# EasyEDA schematic NIR_Schematic.json
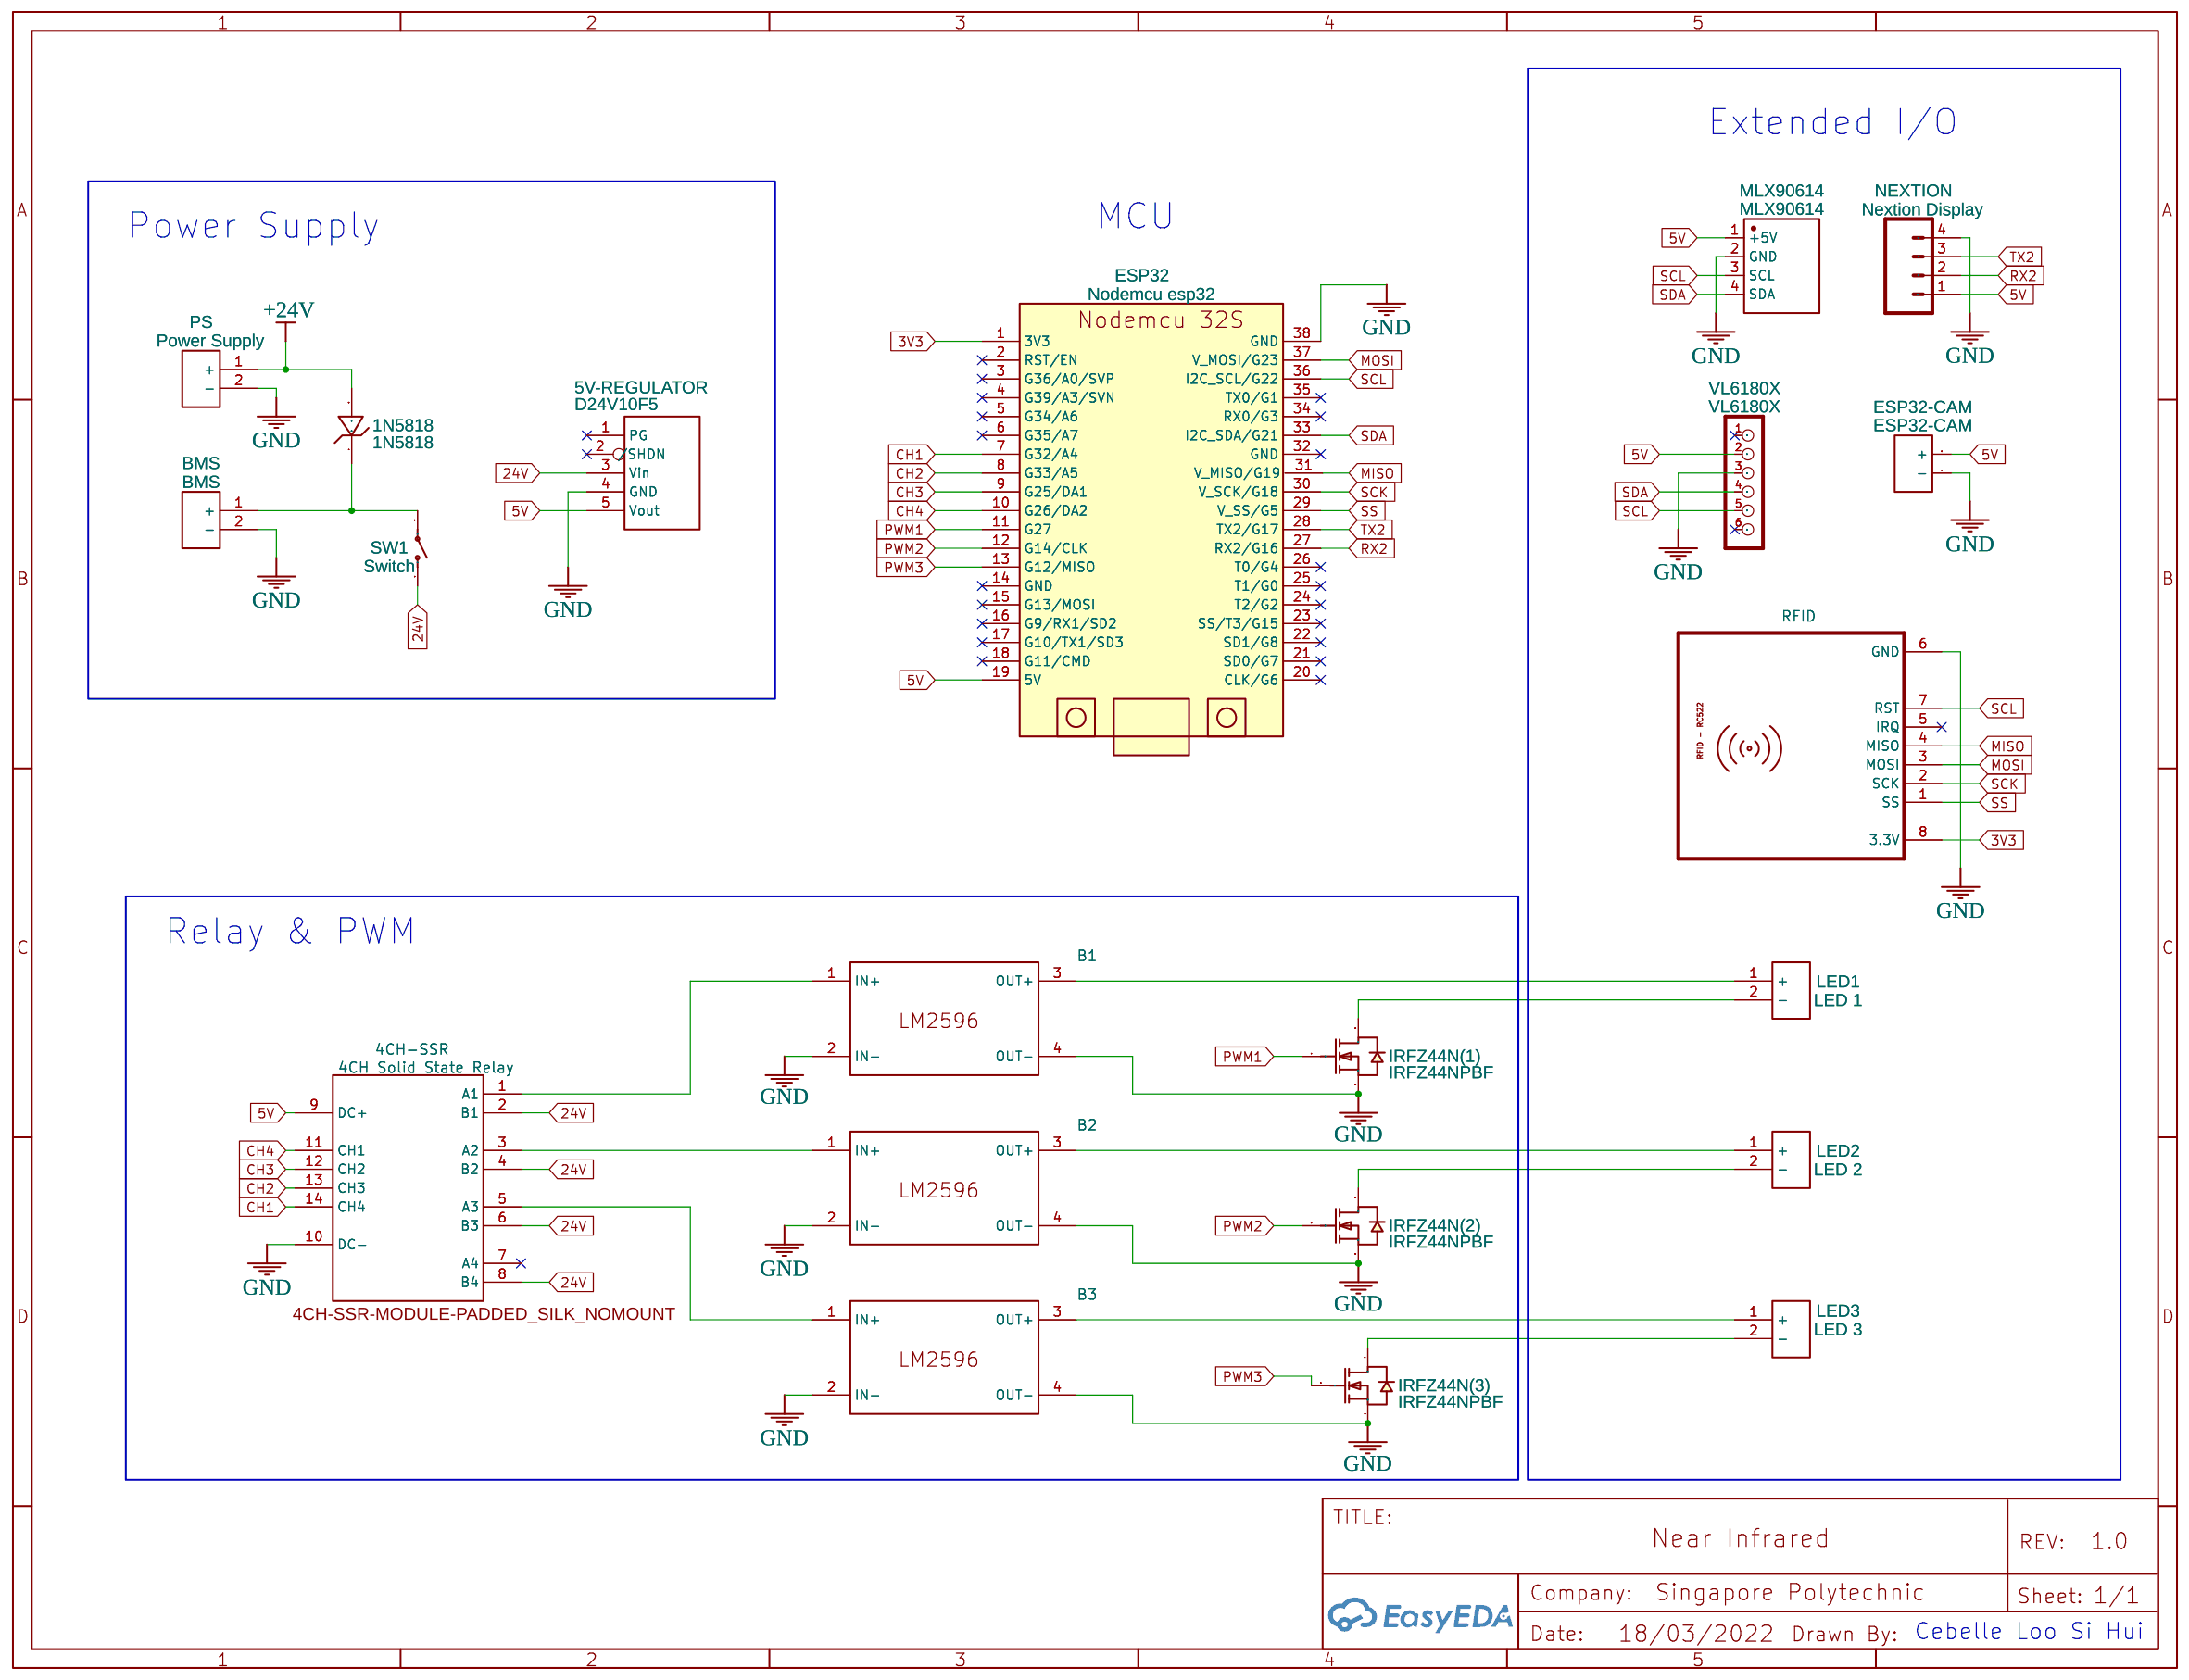
[diagram p0: schematic sheet]

## Parts
1N5818  1N5818  [DO-41_BD2.4-L4.7-P8.70-D0.9-RD]
4CH-SSR  4CH Solid State Relay  [4CH-SSR-MODULE-PADDED_SILK_NOMOUNT]
5V-REGULATOR  D24V10F5  [POLOLU D24V10F5]
B1  NO  [LM2596-MODULE]
B2  NO  [LM2596-MODULE]
B3  NO  [LM2596-MODULE]
BMS  BMS  [2PIN-TERMINALBLOCK-5MM]
ESP32  Nodemcu esp32  [NODEMCU-ESP32S]
ESP32-CAM  ESP32-CAM  [HDR-TH_2P-P2.54-V-F]
IRFZ44N(1)  IRFZ44NPBF  [PG-TO220-3_L10.0-W4.5-P2.54-L]
IRFZ44N(2)  IRFZ44NPBF  [PG-TO220-3_L10.0-W4.5-P2.54-L]
IRFZ44N(3)  IRFZ44NPBF  [PG-TO220-3_L10.0-W4.5-P2.54-L]
LED1  LED 1  [2PIN-TERMINALBLOCK-5MM]
LED2  LED 2  [2PIN-TERMINALBLOCK-5MM]
LED3  LED 3  [2PIN-TERMINALBLOCK-5MM]
MLX90614  MLX90614  [HDR1X4]
NEXTION  Nextion Display  [MOLEX-1X4]
PS  Power Supply  [2PIN-TERMINALBLOCK-5MM]
RFID  NO  [RC522 N]
SW1  Switch  [2PIN-TERMINALBLOCK-5MM]
VL6180X  VL6180X  [M1X6]

## Library data of the parts
1N5818 = 1N5818: Supplier: LCSC; Supplier Part: C402217; Manufacturer: LGE; Contributor: LCSC; JLCPCB Part Class: Extended Part
4CH-SSR = -: Package Display: Yes
5V-REGULATOR = D24V10F5: Contributor: sorinfxdx; sourceId: dNGYgysK2
B1-B3 = -: Package Display: No
BMS LED1 PS = WJ103-5.00-2P: Supplier: LCSC; Manufacturer: ReliaPro; Supplier Part: C8439; JLCPCB Part Class: Extended Part; Package Display: No
ESP32 = Nodemcu esp32: Contributor: SSanya
ESP32-CAM = Header-Female-2.54_1x2: Supplier: LCSC; Manufacturer: BOOMELE; Manufacturer Part: 2.54-1*2PFemale; Supplier Part: C49661; JLCPCB Part Class: Extended Part
IRFZ44N(1) IRFZ44N(2) IRFZ44N(3) = IRFZ44NPBF: Supplier: LCSC; Manufacturer: IR; Supplier Part: C2586; JLCPCB Part Class: Extended Part
LED2 LED3 = WJ103-5.00-2P: Supplier: LCSC; Manufacturer: ReliaPro; Supplier Part: C8439; JLCPCB Part Class: Extended Part
MLX90614 = RE-H042TD-1190(LF)(SN): Supplier: LCSC; Supplier Part: C265319; Manufacturer: JST Sales America; Contributor: LCSC
NEXTION = M04POLAR: Header 4; Contributor: SparkFun
SW1 = SWITCH-2P-SPST-Rocker-10x15mm: Manufacturer Part: KCD1-11-1.5x1cm; Supplier: Aliexpress; link: https://www.aliexpress.com/item/32920360920.html?spm=a2g0s.9042311.0.0.27424c4dCPvDQN; Contributor: shaman0
VL6180X = CON_HEADER_1X06-PTH: Contributor: DangerousPrototype

## Nets
3V3: ESP32.1(3V3) RFID.8(3.3V)
5V: 4CH-SSR.9(DC+) 5V-REGULATOR.5(Vout) ESP32.19(5V) ESP32-CAM.2(+) MLX90614.1(+5V) NEXTION.1(GND) VL6180X.2(VIN)
24V: 4CH-SSR.2(B1) 4CH-SSR.4(B2) 4CH-SSR.6(B3) 4CH-SSR.8(B4) 5V-REGULATOR.3(Vin) SW1.1(O)
+24V: 1N5818.2(A) PS.1(+)
GND: 4CH-SSR.10(DC-) 5V-REGULATOR.4(GND) B1.2(IN-) B1.4(OUT-) B2.2(IN-) B2.4(OUT-) B3.2(IN-) B3.4(OUT-) BMS.2(-) ESP32.38(GND) ESP32-CAM.1(-) IRFZ44N(1).3(S) IRFZ44N(2).3(S) IRFZ44N(3).3(S) MLX90614.2(GND) NEXTION.4(+5V) PS.2(-) RFID.6(GND) VL6180X.3(GND)
CH1: 4CH-SSR.14(CH4) ESP32.7(G32/A4)
CH2: 4CH-SSR.13(CH3) ESP32.8(G33/A5)
CH3: 4CH-SSR.12(CH2) ESP32.9(G25/DA1)
CH4: 4CH-SSR.11(CH1) ESP32.10(G26/DA2)
MISO: ESP32.31(V_MISO/G19) RFID.4(MISO)
MOSI: ESP32.37(V_MOSI/G23) RFID.3(MOSI)
PWM1: ESP32.11(G27) IRFZ44N(1).1(G)
PWM2: ESP32.12(G14/CLK) IRFZ44N(2).1(G)
PWM3: ESP32.13(G12/MISO) IRFZ44N(3).1(G)
RX2: ESP32.27(RX2/G16) NEXTION.2(RX)
SCK: ESP32.30(V_SCK/G18) RFID.2(SCK)
SCL: ESP32.36(I2C SCL/G22) MLX90614.3(SCL) RFID.7(RST) VL6180X.5(SCL)
SDA: ESP32.33(I2C SDA/G21) MLX90614.4(SDA) VL6180X.4(SDA)
SS: ESP32.29(V_SS/G5) RFID.1(SS)
TX2: ESP32.28(TX2/G17) NEXTION.3(TX)
Net-(1N5818-1): 1N5818.1(C) BMS.1(+) SW1.2(P)
Net-(4CH-SSR-1): 4CH-SSR.1(A1) B1.1(IN+)
Net-(4CH-SSR-3): 4CH-SSR.3(A2) B2.1(IN+)
Net-(4CH-SSR-5): 4CH-SSR.5(A3) B3.1(IN+)
Net-(B1-3): B1.3(OUT+) LED1.1(+)
Net-(B2-3): B2.3(OUT+) LED2.1(+)
Net-(B3-3): B3.3(OUT+) LED3.1(+)
Net-(IRFZ44N(1)-2): IRFZ44N(1).2(D) LED1.2(-)
Net-(IRFZ44N(2)-2): IRFZ44N(2).2(D) LED2.2(-)
Net-(IRFZ44N(3)-2): IRFZ44N(3).2(D) LED3.2(-)

Not connected (* = marked no-connect by the designer): 4CH-SSR 7(A4)*; 5V-REGULATOR 1(PG)* 2(/SHDN)*; ESP32 2(RST/EN)* 3(G36/A0/SVP)* 4(G39/A3/SVN)* 5(G34/A6)* 6(G35/A7)* 14(GND)* 15(G13/MOSI)* 16(G9/RX1/SD2)* 17(G10/TX1/SD3)* 18(G11/CMD)* 20(CLK/G6)* 21(SD0/G7)* 22(SD1/G8)* 23(SS/T3/G15)* 24(T2/G2)* 25(T1/G0)* 26(T0/G4)* 32(GND)* 34(RX0/G3)* 35(TX0/G1)*; RFID 5(IRQ)*; VL6180X 1(VDD)* 6(IO1)*

## Notes on the sheet
- Extended I/O
- Power Supply
- MCU
- Relay & PWM
- Cebelle Loo Si Hui
